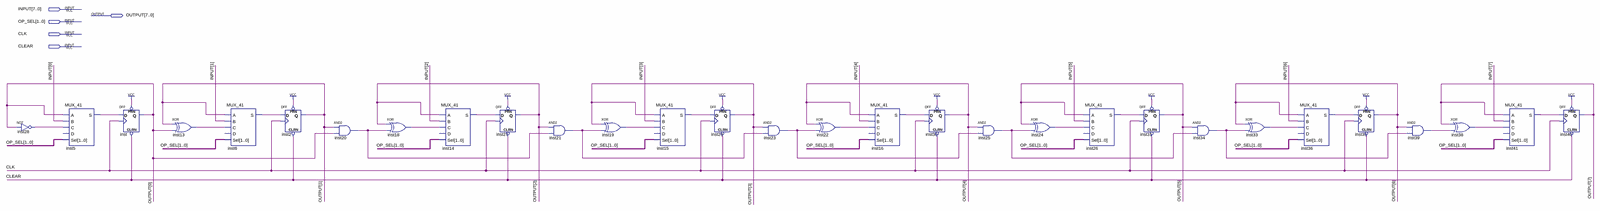
[diagram p0: schematic sheet, whole]
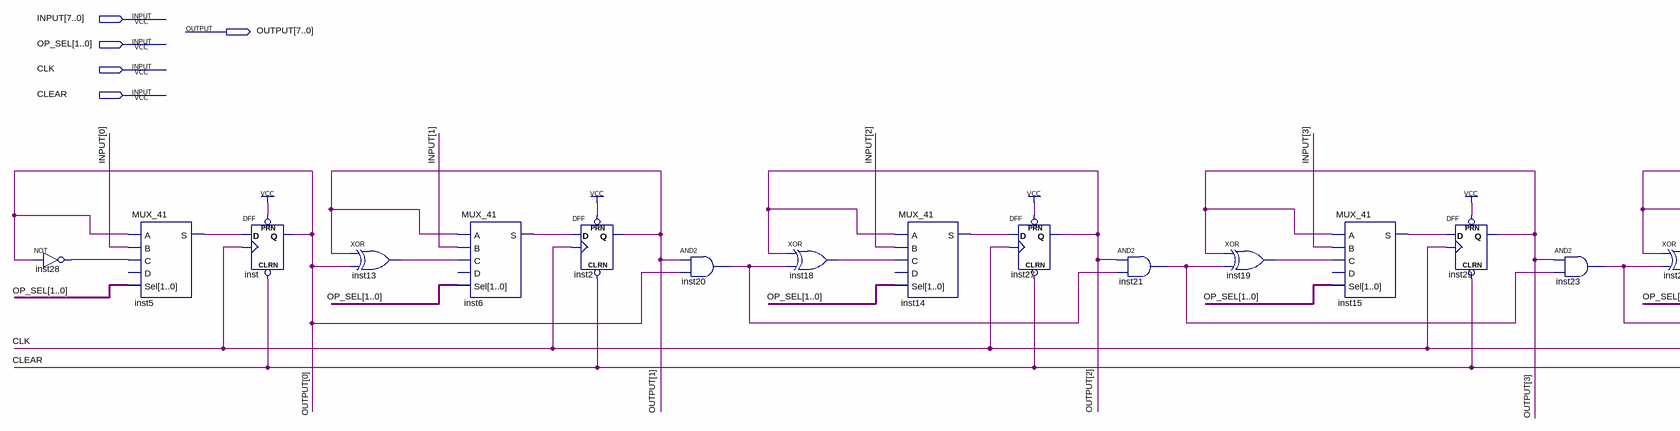
[diagram p1: schematic sheet, left part]
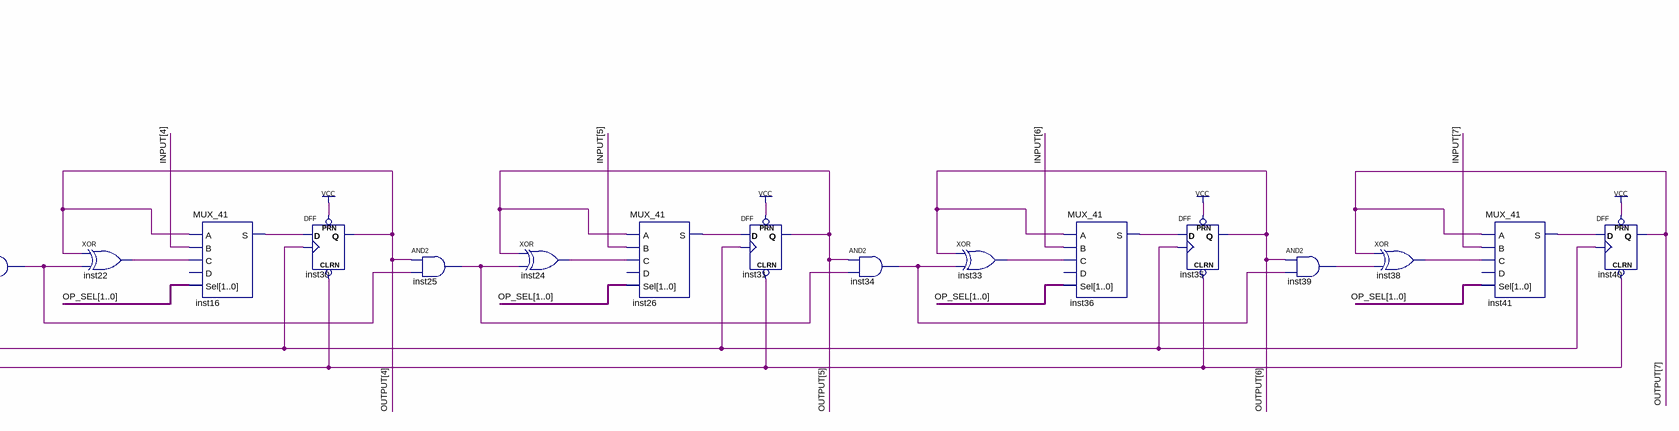
[diagram p2: schematic sheet, right part]
// Quartus schematic PC.bdf as structural Verilog: 30 symbols, 5 pins
module PC (
  input  [7:0] INPUT,
  input  [1:0] OP_SEL,
  input  CLK,
  input  CLEAR,
  output [7:0] OUTPUT
);

  wire inst5_s, inst6_s, inst13_out, inst14_s, inst15_s, inst16_s, inst18_out, inst19_out, inst20_out,
       inst21_out, inst22_out, inst23_out, inst24_out, inst25_out, inst26_s, inst28_out, inst33_out,
       inst34_out, inst36_s, inst38_out, inst39_out, inst41_s;

  not inst28 (inst28_out, OUTPUT[0]);
  MUX_41 inst5 (.A(OUTPUT[0]), .B(INPUT[0]), .C(inst28_out), .Sel(OP_SEL), .S(inst5_s));  // open: D
  DFF inst (.CLRN(CLEAR), .CLK(CLK), .D(inst5_s), .PRN(1'b1), .Q(OUTPUT[0]));
  xor inst13 (inst13_out, OUTPUT[1], OUTPUT[0]);
  MUX_41 inst6 (.A(OUTPUT[1]), .B(INPUT[1]), .C(inst13_out), .Sel(OP_SEL), .S(inst6_s));  // open: D
  DFF inst2 (.CLRN(CLEAR), .CLK(CLK), .D(inst6_s), .PRN(1'b1), .Q(OUTPUT[1]));
  and inst20 (inst20_out, OUTPUT[1], OUTPUT[0]);
  xor inst18 (inst18_out, OUTPUT[2], inst20_out);
  MUX_41 inst14 (.A(OUTPUT[2]), .B(INPUT[2]), .C(inst18_out), .Sel(OP_SEL), .S(inst14_s));  // open: D
  DFF inst27 (.CLRN(CLEAR), .CLK(CLK), .D(inst14_s), .PRN(1'b1), .Q(OUTPUT[2]));
  and inst21 (inst21_out, OUTPUT[2], inst20_out);
  xor inst19 (inst19_out, OUTPUT[3], inst21_out);
  MUX_41 inst15 (.A(OUTPUT[3]), .B(INPUT[3]), .C(inst19_out), .Sel(OP_SEL), .S(inst15_s));  // open: D
  DFF inst29 (.CLRN(CLEAR), .CLK(CLK), .D(inst15_s), .PRN(1'b1), .Q(OUTPUT[3]));
  and inst23 (inst23_out, OUTPUT[3], inst21_out);
  xor inst22 (inst22_out, OUTPUT[4], inst23_out);
  MUX_41 inst16 (.A(OUTPUT[4]), .B(INPUT[4]), .C(inst22_out), .Sel(OP_SEL), .S(inst16_s));  // open: D
  DFF inst30 (.CLRN(CLEAR), .CLK(CLK), .D(inst16_s), .PRN(1'b1), .Q(OUTPUT[4]));
  and inst25 (inst25_out, OUTPUT[4], inst23_out);
  xor inst24 (inst24_out, OUTPUT[5], inst25_out);
  MUX_41 inst26 (.A(OUTPUT[5]), .B(INPUT[5]), .C(inst24_out), .Sel(OP_SEL), .S(inst26_s));  // open: D
  DFF inst31 (.CLRN(CLEAR), .CLK(CLK), .D(inst26_s), .PRN(1'b1), .Q(OUTPUT[5]));
  and inst34 (inst34_out, OUTPUT[5], inst25_out);
  xor inst33 (inst33_out, OUTPUT[6], inst34_out);
  MUX_41 inst36 (.A(OUTPUT[6]), .B(INPUT[6]), .C(inst33_out), .Sel(OP_SEL), .S(inst36_s));  // open: D
  DFF inst35 (.CLRN(CLEAR), .CLK(CLK), .D(inst36_s), .PRN(1'b1), .Q(OUTPUT[6]));
  and inst39 (inst39_out, OUTPUT[6], inst34_out);
  xor inst38 (inst38_out, OUTPUT[7], inst39_out);
  MUX_41 inst41 (.A(OUTPUT[7]), .B(INPUT[7]), .C(inst38_out), .Sel(OP_SEL), .S(inst41_s));  // open: D
  DFF inst40 (.CLRN(CLEAR), .CLK(CLK), .D(inst41_s), .PRN(1'b1), .Q(OUTPUT[7]));
endmodule
